# Altium project project.PrjPcb
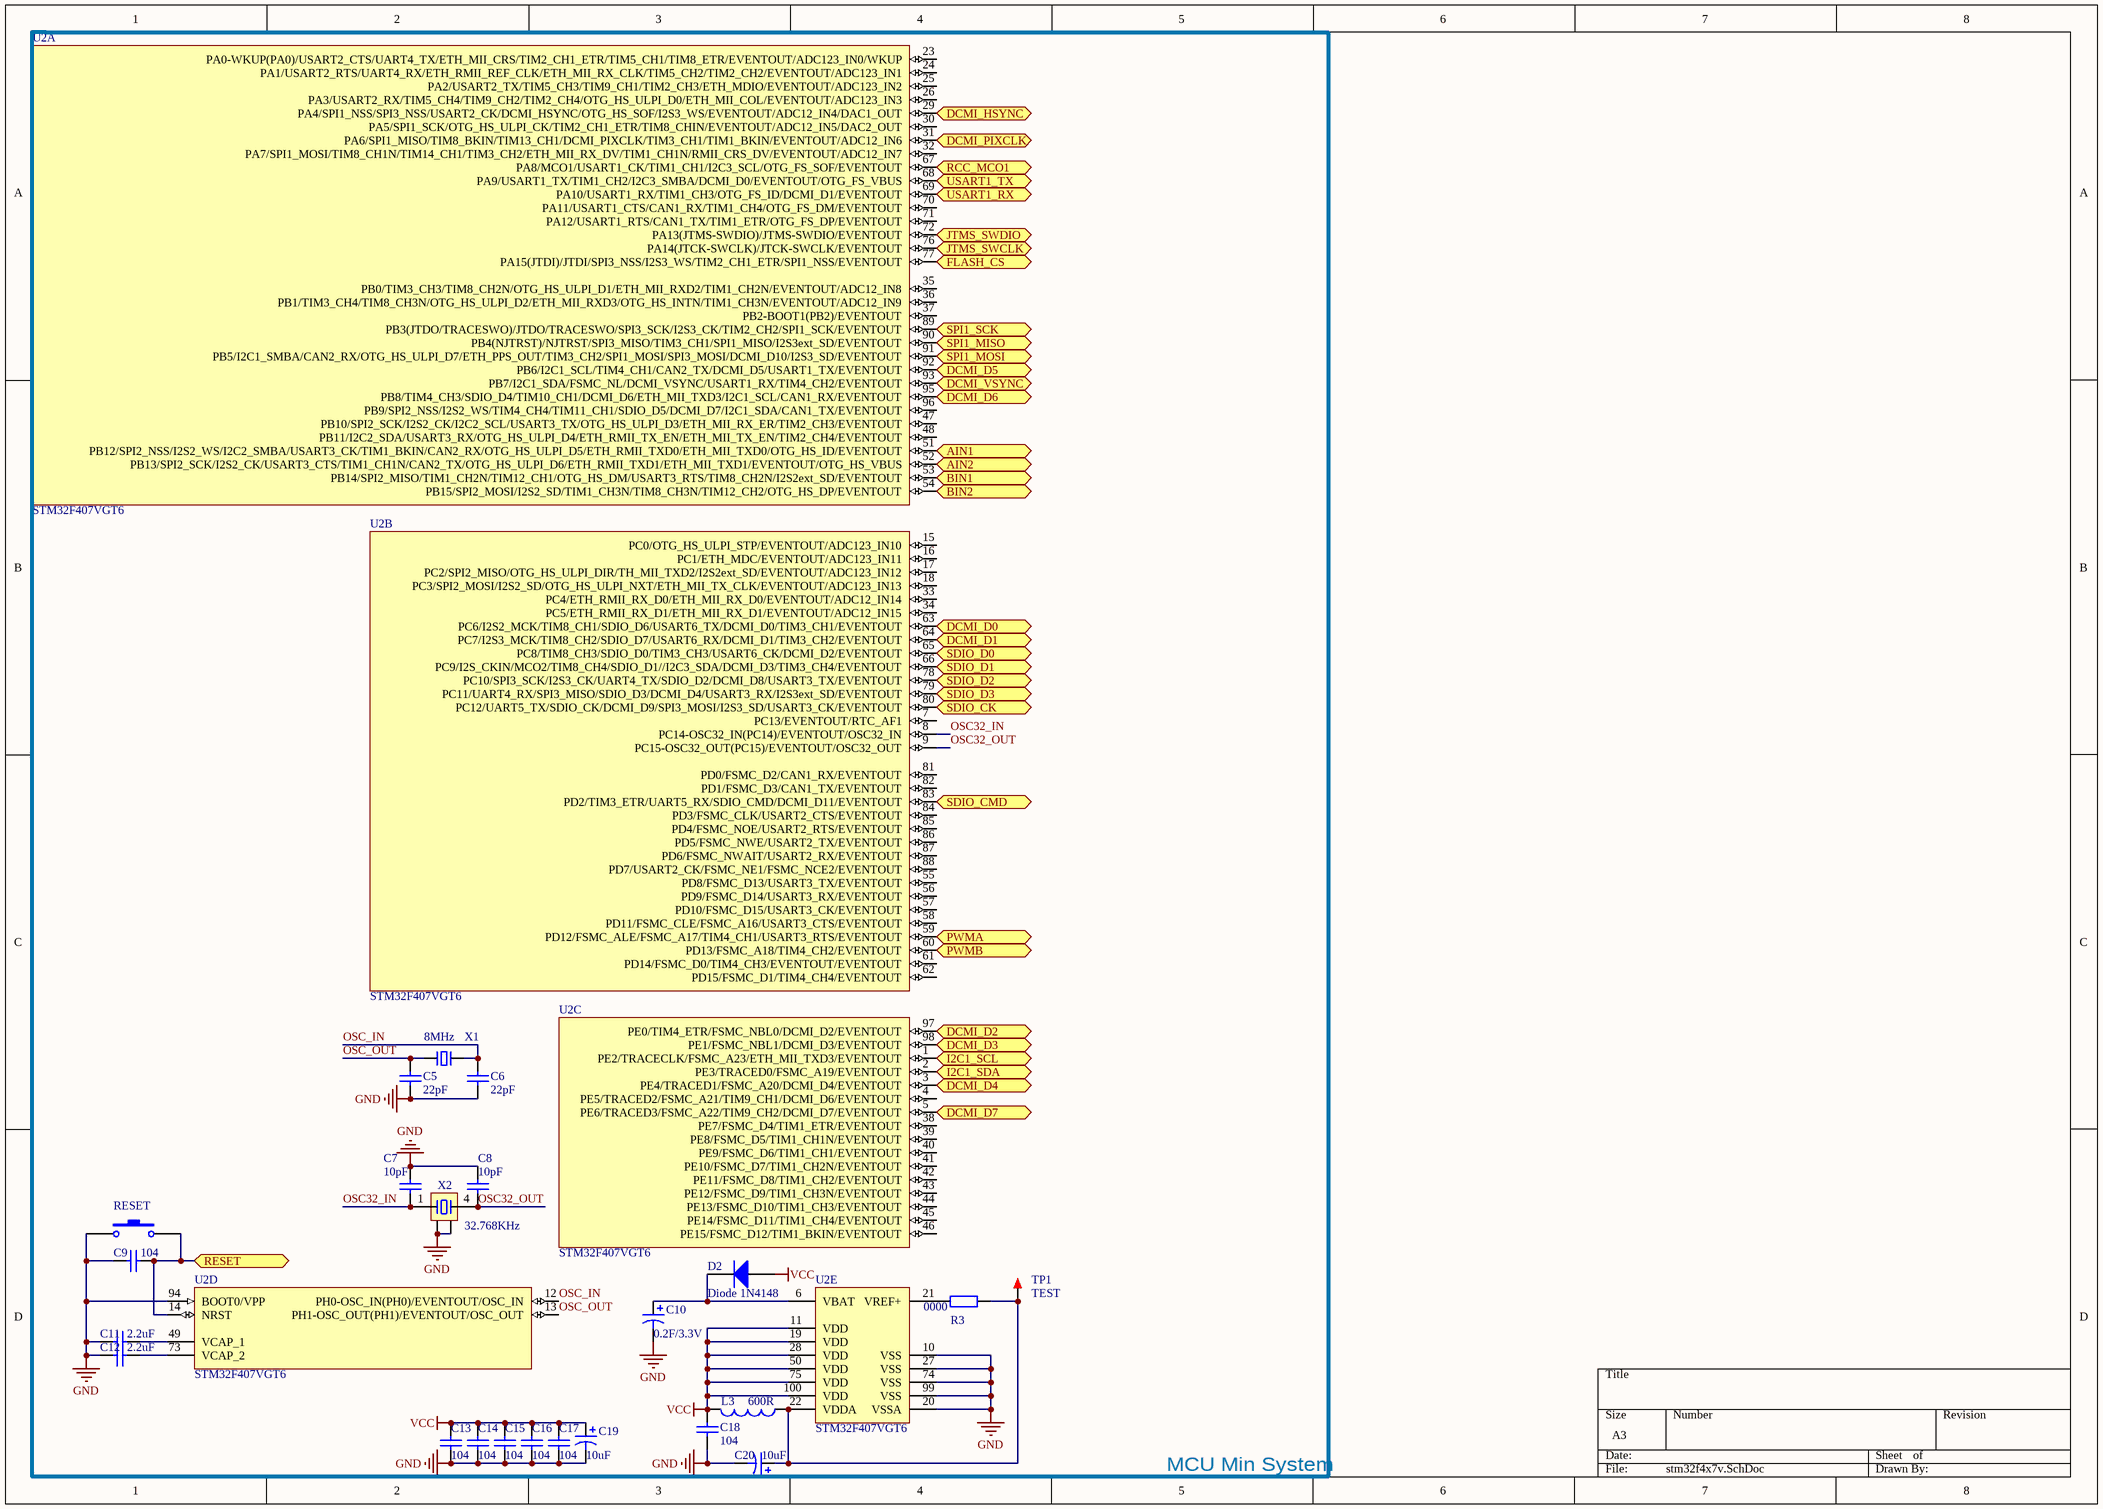
[diagram p0: stm32f4x7v.SchDoc]
5 sheets, 42 parts. Net scope: flat (ports and power ports of the same name join across sheets).
Board file: main_control_board.PcbDoc
Sheets:
  stm32f4x7v.SchDoc
  debug_interface.SchDoc
  power.SchDoc
  spi_flash.SchDoc
  tb6612fng.SchDoc

## Sheet stm32f4x7v.SchDoc
size A3

### Parts
C5  22pF  [C 0603_L]
C6  22pF  [C 0603_L]
C7  10pF  [C 0603_L]
C8  10pF  [C 0603_L]
C9  104  [C 0603_L]
C10  0.2F/3.3V  [CD A(3216)]
C11  2.2uF  [C 0603_L]
C12  2.2uF  [C 0603_L]
C13  104  [C 0603_L]
C14  104  [C 0603_L]
C15  104  [C 0603_L]
C16  104  [C 0603_L]
C17  104  [C 0603_L]
C18  104  [C 0603_L]
C19  10uF  [CD A(3216)]
C20  10uF  [CD A(3216)]
D2  Diode 1N4148  [SOD-523]
L3  value 600R  [R 0603_L]  (hidden comment: Inductor)
R3  0000  [R 0603_L]
RESET  RESET  [micro button_2_SMD]  (value not drawn)
TP1  TEST  [TEST 0.8]
U2  STM32F407VGT6  [LQFP100_V]  (parts A,B,C,D,E of 5)
X1  8MHz  [OSC 5032-2P]
X2  32.768KHz  [OSC MC-146]

### Blocks framed on the sheet
MCU Min System: C5-C20 D2 L3 R3 RESET TP1 U2 X1 X2

### Ports
AIN1 (bidir), AIN2 (bidir), BIN1 (bidir), BIN2 (bidir), DCMI_D0 (bidir), DCMI_D1 (bidir), DCMI_D2 (bidir), DCMI_D3 (bidir), DCMI_D4 (bidir), DCMI_D5 (bidir), DCMI_D6 (bidir), DCMI_D7 (bidir), DCMI_HSYNC (bidir), DCMI_PIXCLK (bidir), DCMI_VSYNC (bidir), FLASH_CS (bidir), I2C1_SCL (bidir), I2C1_SDA (bidir), JTMS_SWCLK (bidir), JTMS_SWDIO (bidir), PWMA (bidir), PWMB (bidir), RCC_MCO1 (bidir), RESET (bidir), SDIO_CK (bidir), SDIO_CMD (bidir), SDIO_D0 (bidir), SDIO_D1 (bidir), SDIO_D2 (bidir), SDIO_D3 (bidir), SPI1_MISO (bidir), SPI1_MOSI (bidir), SPI1_SCK (bidir), USART1_RX (bidir), USART1_TX (bidir)

### Nets
GND: C5.1 C6.1 C7.2 C8.2 C9.1 C10.2 C11.1 C12.1 C13.1 C14.1 C15.1 C16.1 C17.1 C18.1 C19.2 C20.2 RESET.1 U2.10(VSS) U2.20(VSSA) U2.27(VSS) U2.74(VSS) U2.94(BOOT0/VPP) U2.99(VSS) X2.2 X2.3
VCC: C13.2 C14.2 C15.2 C16.2 C17.2 C18.2 C19.1 D2.1(A) L3.2 U2.11(VDD) U2.19(VDD) U2.28(VDD) U2.50(VDD) U2.75(VDD) U2.100(VDD)
OSC32_IN: C7.1 U2.8(PC14-OSC32_IN(PC14)/EVENTOUT/OSC32_IN) X2.1
OSC32_OUT: C8.1 U2.9(PC15-OSC32_OUT(PC15)/EVENTOUT/OSC32_OUT) X2.4
OSC_IN: C6.2 U2.12(PH0-OSC_IN(PH0)/EVENTOUT/OSC_IN) X1.2
OSC_OUT: C5.2 U2.13(PH1-OSC_OUT(PH1)/EVENTOUT/OSC_OUT) X1.1
NetC9_2: C9.2 RESET.2 U2.14(NRST) ; port RESET
NetC10_1: C10.1 D2.2(K) U2.6(VBAT)
NetC11_2: C11.2 U2.49(VCAP_1)
NetC12_2: C12.2 U2.73(VCAP_2)
NetC20_1: C20.1 L3.1 R3.1 TP1.1 U2.22(VDDA)
NetIC2_1: U2.77(PA15(JTDI)/JTDI/SPI3_NSS/I2S3_WS/TIM2_CH1_ETR/SPI1_NSS/EVENTOUT) ; port FLASH_CS
NetIC2_2: U2.90(PB4(NJTRST)/NJTRST/SPI3_MISO/TIM3_CH1/SPI1_MISO/I2S3ext_SD/EVENTOUT) ; port SPI1_MISO
NetIC2_5: U2.91(PB5/I2C1_SMBA/CAN2_RX/OTG_HS_ULPI_D7/ETH_PPS_OUT/TIM3_CH2/SPI1_MOSI/SPI3_MOSI/DCMI_D10/I2S3_SD/EVENTOUT) ; port SPI1_MOSI
NetIC2_6: U2.89(PB3(JTDO/TRACESWO)/JTDO/TRACESWO/SPI3_SCK/I2S3_CK/TIM2_CH2/SPI1_SCK/EVENTOUT) ; port SPI1_SCK
NetJP2_2: U2.69(PA10/USART1_RX/TIM1_CH3/OTG_FS_ID/DCMI_D1/EVENTOUT) ; port USART1_RX
NetJP2_3: U2.68(PA9/USART1_TX/TIM1_CH2/I2C3_SMBA/DCMI_D0/EVENTOUT/OTG_FS_VBUS) ; port USART1_TX
NetJP3_2: U2.72(PA13(JTMS-SWDIO)/JTMS-SWDIO/EVENTOUT) ; port JTMS_SWDIO
NetJP3_3: U2.76(PA14(JTCK-SWCLK)/JTCK-SWCLK/EVENTOUT) ; port JTMS_SWCLK
NetR3_2: R3.2 U2.21(VREF+)
NetU2_1: U2.1(PE2/TRACECLK/FSMC_A23/ETH_MII_TXD3/EVENTOUT) ; port I2C1_SCL
NetU2_2: U2.2(PE3/TRACED0/FSMC_A19/EVENTOUT) ; port I2C1_SDA
NetU2_3: U2.3(PE4/TRACED1/FSMC_A20/DCMI_D4/EVENTOUT) ; port DCMI_D4
NetU2_5: U2.5(PE6/TRACED3/FSMC_A22/TIM9_CH2/DCMI_D7/EVENTOUT) ; port DCMI_D7
NetU2_29: U2.29(PA4/SPI1_NSS/SPI3_NSS/USART2_CK/DCMI_HSYNC/OTG_HS_SOF/I2S3_WS/EVENTOUT/ADC12_IN4/DAC1_OUT) ; port DCMI_HSYNC
NetU2_31: U2.31(PA6/SPI1_MISO/TIM8_BKIN/TIM13_CH1/DCMI_PIXCLK/TIM3_CH1/TIM1_BKIN/EVENTOUT/ADC12_IN6) ; port DCMI_PIXCLK
NetU2_51: U2.51(PB12/SPI2_NSS/I2S2_WS/I2C2_SMBA/USART3_CK/TIM1_BKIN/CAN2_RX/OTG_HS_ULPI_D5/ETH_RMII_TXD0/ETH_MII_TXD0/OTG_HS_ID/EVENTOUT) ; port AIN1
NetU2_52: U2.52(PB13/SPI2_SCK/I2S2_CK/USART3_CTS/TIM1_CH1N/CAN2_TX/OTG_HS_ULPI_D6/ETH_RMII_TXD1/ETH_MII_TXD1/EVENTOUT/OTG_HS_VBUS) ; port AIN2
NetU2_53: U2.53(PB14/SPI2_MISO/TIM1_CH2N/TIM12_CH1/OTG_HS_DM/USART3_RTS/TIM8_CH2N/I2S2ext_SD/EVENTOUT) ; port BIN1
NetU2_54: U2.54(PB15/SPI2_MOSI/I2S2_SD/TIM1_CH3N/TIM8_CH3N/TIM12_CH2/OTG_HS_DP/EVENTOUT) ; port BIN2
NetU2_59: U2.59(PD12/FSMC_ALE/FSMC_A17/TIM4_CH1/USART3_RTS/EVENTOUT) ; port PWMA
NetU2_60: U2.60(PD13/FSMC_A18/TIM4_CH2/EVENTOUT) ; port PWMB
NetU2_63: U2.63(PC6/I2S2_MCK/TIM8_CH1/SDIO_D6/USART6_TX/DCMI_D0/TIM3_CH1/EVENTOUT) ; port DCMI_D0
NetU2_64: U2.64(PC7/I2S3_MCK/TIM8_CH2/SDIO_D7/USART6_RX/DCMI_D1/TIM3_CH2/EVENTOUT) ; port DCMI_D1
NetU2_65: U2.65(PC8/TIM8_CH3/SDIO_D0/TIM3_CH3/USART6_CK/DCMI_D2/EVENTOUT) ; port SDIO_D0
NetU2_66: U2.66(PC9/I2S_CKIN/MCO2/TIM8_CH4/SDIO_D1//I2C3_SDA/DCMI_D3/TIM3_CH4/EVENTOUT) ; port SDIO_D1
NetU2_67: U2.67(PA8/MCO1/USART1_CK/TIM1_CH1/I2C3_SCL/OTG_FS_SOF/EVENTOUT) ; port RCC_MCO1
NetU2_78: U2.78(PC10/SPI3_SCK/I2S3_CK/UART4_TX/SDIO_D2/DCMI_D8/USART3_TX/EVENTOUT) ; port SDIO_D2
NetU2_79: U2.79(PC11/UART4_RX/SPI3_MISO/SDIO_D3/DCMI_D4/USART3_RX/I2S3ext_SD/EVENTOUT) ; port SDIO_D3
NetU2_80: U2.80(PC12/UART5_TX/SDIO_CK/DCMI_D9/SPI3_MOSI/I2S3_SD/USART3_CK/EVENTOUT) ; port SDIO_CK
NetU2_83: U2.83(PD2/TIM3_ETR/UART5_RX/SDIO_CMD/DCMI_D11/EVENTOUT) ; port SDIO_CMD
NetU2_92: U2.92(PB6/I2C1_SCL/TIM4_CH1/CAN2_TX/DCMI_D5/USART1_TX/EVENTOUT) ; port DCMI_D5
NetU2_93: U2.93(PB7/I2C1_SDA/FSMC_NL/DCMI_VSYNC/USART1_RX/TIM4_CH2/EVENTOUT) ; port DCMI_VSYNC
NetU2_95: U2.95(PB8/TIM4_CH3/SDIO_D4/TIM10_CH1/DCMI_D6/ETH_MII_TXD3/I2C1_SCL/CAN1_RX/EVENTOUT) ; port DCMI_D6
NetU2_97: U2.97(PE0/TIM4_ETR/FSMC_NBL0/DCMI_D2/EVENTOUT) ; port DCMI_D2
NetU2_98: U2.98(PE1/FSMC_NBL1/DCMI_D3/EVENTOUT) ; port DCMI_D3

Not connected (* = marked no-connect by the designer): U2 4(PE5/TRACED2/FSMC_A21/TIM9_CH1/DCMI_D6/EVENTOUT) 7(PC13/EVENTOUT/RTC_AF1) 15(PC0/OTG_HS_ULPI_STP/EVENTOUT/ADC123_IN10) 16(PC1/ETH_MDC/EVENTOUT/ADC123_IN11) 17(PC2/SPI2_MISO/OTG_HS_ULPI_DIR/TH_MII_TXD2/I2S2ext_SD/EVENTOUT/ADC123_IN12) 18(PC3/SPI2_MOSI/I2S2_SD/OTG_HS_ULPI_NXT/ETH_MII_TX_CLK/EVENTOUT/ADC123_IN13) 23(PA0-WKUP(PA0)/USART2_CTS/UART4_TX/ETH_MII_CRS/TIM2_CH1_ETR/TIM5_CH1/TIM8_ETR/EVENTOUT/ADC123_IN0/WKUP) 24(PA1/USART2_RTS/UART4_RX/ETH_RMII_REF_CLK/ETH_MII_RX_CLK/TIM5_CH2/TIM2_CH2/EVENTOUT/ADC123_IN1) 25(PA2/USART2_TX/TIM5_CH3/TIM9_CH1/TIM2_CH3/ETH_MDIO/EVENTOUT/ADC123_IN2) 26(PA3/USART2_RX/TIM5_CH4/TIM9_CH2/TIM2_CH4/OTG_HS_ULPI_D0/ETH_MII_COL/EVENTOUT/ADC123_IN3) 30(PA5/SPI1_SCK/OTG_HS_ULPI_CK/TIM2_CH1_ETR/TIM8_CHIN/EVENTOUT/ADC12_IN5/DAC2_OUT) 32(PA7/SPI1_MOSI/TIM8_CH1N/TIM14_CH1/TIM3_CH2/ETH_MII_RX_DV/TIM1_CH1N/RMII_CRS_DV/EVENTOUT/ADC12_IN7) 33(PC4/ETH_RMII_RX_D0/ETH_MII_RX_D0/EVENTOUT/ADC12_IN14) 34(PC5/ETH_RMII_RX_D1/ETH_MII_RX_D1/EVENTOUT/ADC12_IN15) 35(PB0/TIM3_CH3/TIM8_CH2N/OTG_HS_ULPI_D1/ETH_MII_RXD2/TIM1_CH2N/EVENTOUT/ADC12_IN8) 36(PB1/TIM3_CH4/TIM8_CH3N/OTG_HS_ULPI_D2/ETH_MII_RXD3/OTG_HS_INTN/TIM1_CH3N/EVENTOUT/ADC12_IN9) 37(PB2-BOOT1(PB2)/EVENTOUT) 38(PE7/FSMC_D4/TIM1_ETR/EVENTOUT) 39(PE8/FSMC_D5/TIM1_CH1N/EVENTOUT) 40(PE9/FSMC_D6/TIM1_CH1/EVENTOUT) 41(PE10/FSMC_D7/TIM1_CH2N/EVENTOUT) 42(PE11/FSMC_D8/TIM1_CH2/EVENTOUT) 43(PE12/FSMC_D9/TIM1_CH3N/EVENTOUT) 44(PE13/FSMC_D10/TIM1_CH3/EVENTOUT) 45(PE14/FSMC_D11/TIM1_CH4/EVENTOUT) 46(PE15/FSMC_D12/TIM1_BKIN/EVENTOUT) 47(PB10/SPI2_SCK/I2S2_CK/I2C2_SCL/USART3_TX/OTG_HS_ULPI_D3/ETH_MII_RX_ER/TIM2_CH3/EVENTOUT) 48(PB11/I2C2_SDA/USART3_RX/OTG_HS_ULPI_D4/ETH_RMII_TX_EN/ETH_MII_TX_EN/TIM2_CH4/EVENTOUT) 55(PD8/FSMC_D13/USART3_TX/EVENTOUT) 56(PD9/FSMC_D14/USART3_RX/EVENTOUT) 57(PD10/FSMC_D15/USART3_CK/EVENTOUT) 58(PD11/FSMC_CLE/FSMC_A16/USART3_CTS/EVENTOUT) 61(PD14/FSMC_D0/TIM4_CH3/EVENTOUT/EVENTOUT) 62(PD15/FSMC_D1/TIM4_CH4/EVENTOUT) 70(PA11/USART1_CTS/CAN1_RX/TIM1_CH4/OTG_FS_DM/EVENTOUT) 71(PA12/USART1_RTS/CAN1_TX/TIM1_ETR/OTG_FS_DP/EVENTOUT) 81(PD0/FSMC_D2/CAN1_RX/EVENTOUT) 82(PD1/FSMC_D3/CAN1_TX/EVENTOUT) 84(PD3/FSMC_CLK/USART2_CTS/EVENTOUT) 85(PD4/FSMC_NOE/USART2_RTS/EVENTOUT) 86(PD5/FSMC_NWE/USART2_TX/EVENTOUT) 87(PD6/FSMC_NWAIT/USART2_RX/EVENTOUT) 88(PD7/USART2_CK/FSMC_NE1/FSMC_NCE2/EVENTOUT) 96(PB9/SPI2_NSS/I2S2_WS/TIM4_CH4/TIM11_CH1/SDIO_D5/DCMI_D7/I2C1_SDA/CAN1_TX/EVENTOUT)

### Library data of the parts
C5-C9 C11-C18 = Cap: Capacitor; Published: 8-Jun-2000; LatestRevisionDate: 17-Jul-2002; LatestRevisionNote: Re-released for DXP Platform.; PackageReference: RAD-0.3; Publisher: Altium Limited; PackageDescription: Radial Cap, Thru-Hole; 2 Leads; 0.3 in Pin Spacing
  C5 C6: Value: 22pF
  C7 C8: Value: 10pF
  C9 C13-C18: Value: 104
  C11 C12: Value: 2.2uF
C10 C19 C20 = Cap Pol1: Polarized Capacitor (Radial); Published: 8-Jun-2000; LatestRevisionDate: 17-Jul-2002; LatestRevisionNote: Re-released for DXP Platform.; PackageReference: RB7.6-15; Publisher: Altium Limited; PackageDescription: Polarized Capacitor (Radial); 2 Leads
  C10: Value: 0.2F/3.3V
  C19 C20: Value: 10uF
D2 = Diode 1N4148: High Conductance Fast Diode; Published: 8-Jun-2000; LatestRevisionDate: 17-Jul-2002; LatestRevisionNote: Re-released for DXP Platform.; DatasheetVersion: 1997; PackageReference: DO-35; Publisher: Altium Limited; PackageDescription: Diode, Axial; Body 3.8 x 1.9 mm (LxDia. max), Lead Dia. 0.53 mm (max); Code_JEDEC: DO-204-AH; ComponentLink1Description: Manufacturer Link; ComponentLink1URL: http://www.fairchildsemi.com/; ComponentLink2Description: Datasheet; ComponentLink2URL: http://www.fairchildsemi.com/ds/1N%2F1N4148.pdf
L3 = Inductor: Code_IEC: 1005; Published: 8-Jun-2000; LatestRevisionDate: 29-May-2009; LatestRevisionNote: IPC-7351 Footprint Added.; PackageReference: 0402-A; Publisher: Altium Limited; PackageDescription: Chip Inductor; Code_JEITA: 0402
R3 = Res2: Resistor; Published: 8-Jun-2000; LatestRevisionDate: 17-Jul-2002; LatestRevisionNote: Re-released for DXP Platform.; PackageReference: AXIAL-0.4; Publisher: Altium Limited; PackageDescription: Axial Device, Thru-Hole; 2 Leads; 0.4 in Pin Spacing; Value: 0000
RESET = SW-PB: Switch; Published: 24-Mar-1999; LatestRevisionDate: 17-Jul-2002; LatestRevisionNote: Re-released for DXP Platform.; PackageReference: SPST-2; Publisher: Altium Limited; PackageDescription: Switch; 2 Leads
TP1 = TEST: 测试点; 版权归属: 源创客; BOM名称: 测试点; 学习资源: www.ooocke.com
U2 = STM32F407VGT6: ARM Cortex-M4 32b MCU+FPU, 210DMIP, 1024 kB Flash, 192+4 kB RAM, Camera, 82 I/Os, 100-pin LQFP, -40 to +85癈, Tray; Internal RAM: 192kB; Operating Frequency (Processor Speed): 168MHz; A/D Converter: 16x12-bit; D/A Converter: 2x12-bit; 16-bit Timers (IC/OC/PWM): 12x16-bit(24/24/30); 32-bit Timer (IC/OC/PWM): 2x32-bit (8/8/8); Other Timer Functions: 2xWDG, RTC, 24-bit down counter; Serial Interface: 3xSPI/2xI2S/2xI2C/3xUSART(IrDa, ISO7816)/3xUART/2xUSB OTG FS/HS, 2xCAN/Ethernet MAC10/100, SDIO; DatasheetVersion: rev2, Jan-2012; PackageVersion: 2012; PackageReference: LQFP100; PackageDescription: 100-Pin Low Profile Quad Flat Package, 14x14 mm Body, 0.5 mm Pitch; ComponentLink1Description: Manufacturer URL; ComponentLink1URL: http://www.st.com/; ComponentLink2Description: STM32F405/7 Datasheet; ComponentLink2URL: http://www.st.com/internet/com/TECHNICAL_RESOURCES/TECHNICAL_LITERATURE/DATASHEET/DM00037051.pdf; ComponentLink3Description: STM32F4 Web Page; ComponentLink3URL: http://www.st.com/internet/mcu/subclass/1521.jsp
X1 = XTAL-2P: 2脚无源脚晶振; 版权归属: 源创客; BOM名称: 2脚无源脚晶振; 学习资源: www.ooocke.com
X2 = XTAL-MC-4P: MC系列4脚晶振; BOM名称: 2脚无源脚晶振; 版权归属: 源创客; 学习资源: www.ooocke.com

## Sheet debug_interface.SchDoc
size A4
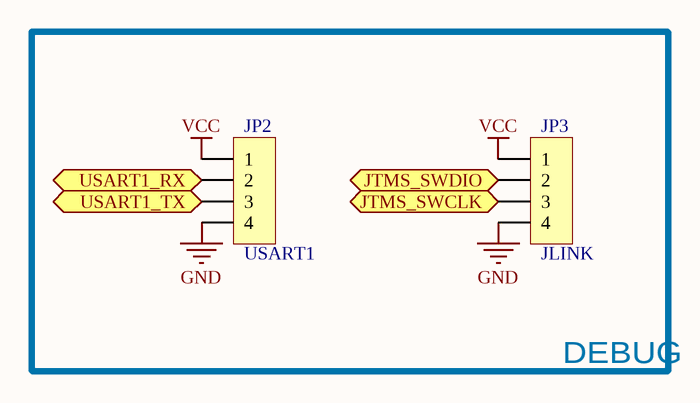
[diagram p1: debug_interface.SchDoc]

### Parts
JP2  USART1  [MX 1.25-LS-4P]
JP3  JLINK  [MX 1.25-LS-4P]

### Blocks framed on the sheet
DEBUG: JP2 JP3

### Ports
JTMS_SWCLK (bidir), JTMS_SWDIO (bidir), USART1_RX (bidir), USART1_TX (bidir)

### Nets
GND: JP2.4 JP3.4
VCC: JP2.1 JP3.1
NetJP2_2: JP2.2 ; port USART1_RX
NetJP2_3: JP2.3 ; port USART1_TX
NetJP3_2: JP3.2 ; port JTMS_SWDIO
NetJP3_3: JP3.3 ; port JTMS_SWCLK

### Library data of the parts
JP2 JP3 = Header 4: 4P接插件; 版权归属: 源创客; BOM名称: 4P接插件; 学习资源: www.ooocke.com

## Sheet power.SchDoc
size A4
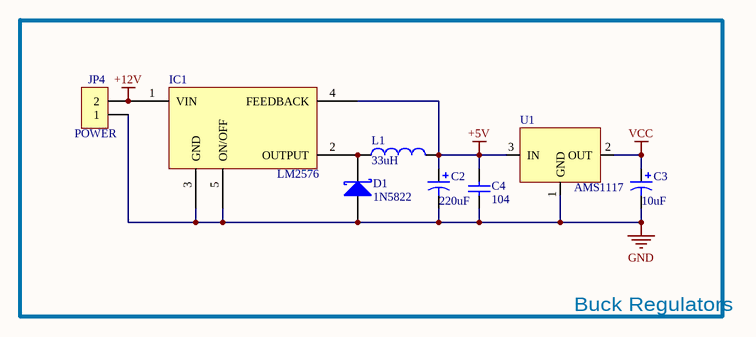
[diagram p2: power.SchDoc]

### Parts
C2  220uF  [CM E(8*10.2)]
C3  10uF  [CD A(3216)]
C4  104  [C 0603_L]
D1  1N5822  [DO_201_AD]
IC1  LM2576  [TO263-5A]
JP4  POWER  [KF128-5.08-2P]
L1  33uH  [CDRH127]
U1  AMS1117  [SOT_223]

### Blocks framed on the sheet
Buck Regulators: C2-C4 D1 IC1 JP4 L1 U1

### Nets
+5V: C2.1 C4.2 IC1.4(FEEDBACK) L1.2 U1.3(IN)
+12V: IC1.1(VIN) JP4.2
GND: C2.2 C3.2 C4.1 D1.1(A) IC1.3(GND) IC1.5(ON/OFF) JP4.1 U1.1(GND)
VCC: C3.1 U1.2(OUT)
NetD1_2: D1.2(K) IC1.2(OUTPUT) L1.1

### Library data of the parts
C2 C3 = Cap Pol1: Polarized Capacitor (Radial); Published: 8-Jun-2000; LatestRevisionDate: 17-Jul-2002; LatestRevisionNote: Re-released for DXP Platform.; PackageReference: RB7.6-15; Publisher: Altium Limited; PackageDescription: Polarized Capacitor (Radial); 2 Leads
  C2: Value: 220uF
  C3: Value: 10uF
C4 = Cap: Capacitor; Published: 8-Jun-2000; LatestRevisionDate: 17-Jul-2002; LatestRevisionNote: Re-released for DXP Platform.; PackageReference: RAD-0.3; Publisher: Altium Limited; PackageDescription: Radial Cap, Thru-Hole; 2 Leads; 0.3 in Pin Spacing; Value: 104
D1 = Diode 11DQ03: Schottky Rectifier; Published: 8-Jun-2000; LatestRevisionDate: 17-Jul-2002; LatestRevisionNote: Re-released for DXP Platform.; DatasheetVersion: Dec-1997; PackageReference: DO-204AL; Publisher: Altium Limited; PackageDescription: Diode, Axial; Body 5.2 x 2.7 mm (LxDia. max), Lead Dia. 0.86 mm (max); Code_JEDEC: DO-204-AL; ComponentLink1Description: Manufacturer Link; ComponentLink1URL: http://www.irf.com/; ComponentLink2Description: Datasheet; ComponentLink2URL: http://www.irf.com/product-info/datasheets/data/11dq03.pdf
IC1 = LM2576: 稳压
JP4 = Header 2: 2P接插件; 版权归属: 源创客; BOM名称: 2P接插件; 学习资源: www.ooocke.com
L1 = Inductor: Code_IEC: 1005; Published: 8-Jun-2000; LatestRevisionDate: 29-May-2009; LatestRevisionNote: IPC-7351 Footprint Added.; PackageReference: 0402-A; Publisher: Altium Limited; PackageDescription: Chip Inductor; Code_JEITA: 0402; Value: 33uH

## Sheet spi_flash.SchDoc
size A4
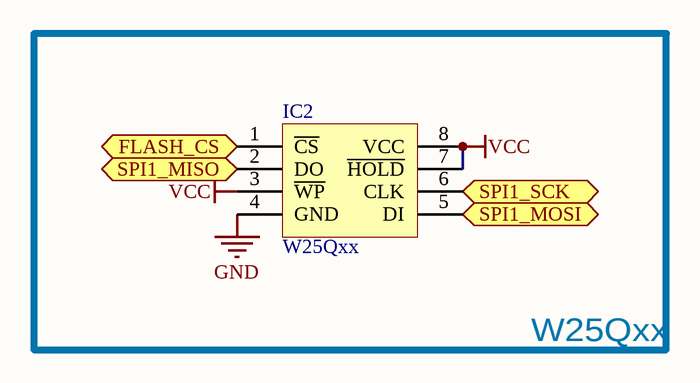
[diagram p3: spi_flash.SchDoc]

### Parts
IC2  W25Qxx  [SOP8W_N]

### Blocks framed on the sheet
W25Qxx: IC2

### Ports
FLASH_CS (bidir), SPI1_MISO (bidir), SPI1_MOSI (bidir), SPI1_SCK (bidir)

### Nets
GND: IC2.4(GND)
VCC: IC2.3(~{WP}) IC2.7(~{HOLD}) IC2.8(VCC)
NetIC2_1: IC2.1(~{CS}) ; port FLASH_CS
NetIC2_2: IC2.2(DO) ; port SPI1_MISO
NetIC2_5: IC2.5(DI) ; port SPI1_MOSI
NetIC2_6: IC2.6(CLK) ; port SPI1_SCK

### Library data of the parts
IC2 = W25Qxx: 外置Flash; 版权归属: 源创客; BOM名称: 外置Flash; 学习资源: www.ooocke.com

## Sheet tb6612fng.SchDoc
size A4
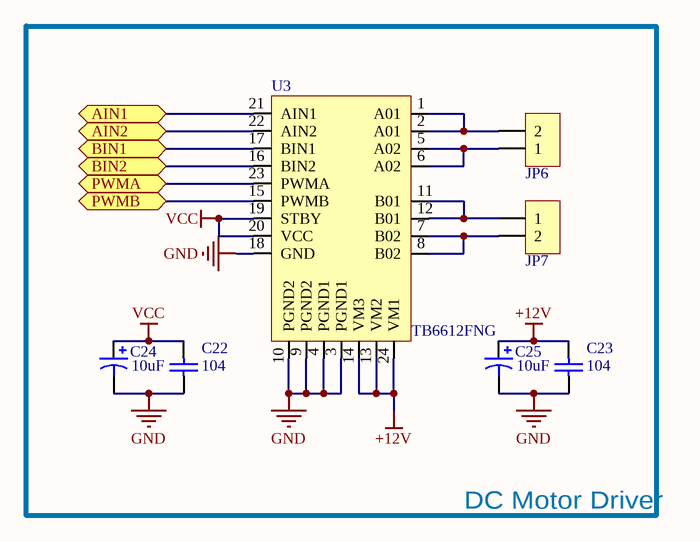
[diagram p4: tb6612fng.SchDoc]

### Parts
C22  104  [C 0603_L]
C23  104  [C 0603_L]
C24  10uF  [CD A(3216)]
C25  10uF  [CD A(3216)]
JP6  HDR-1X2  [XH2.54-LI-2P]  (value not drawn)
JP7  HDR-1X2  [XH2.54-LI-2P]  (value not drawn)
U3  TB6612FNG  [SSOP24_N]

### Blocks framed on the sheet
DC Motor Driver: C22-C25 JP6 JP7 U3

### Ports
AIN1 (bidir), AIN2 (bidir), BIN1 (bidir), BIN2 (bidir), PWMA (bidir), PWMB (bidir)

### Nets
+12V: C23.2 C25.1 U3.13(VM2) U3.14(VM3) U3.24(VM1)
GND: C22.1 C23.1 C24.2 C25.2 U3.3(PGND1) U3.4(PGND1) U3.9(PGND2) U3.10(PGND2) U3.18(GND)
VCC: C22.2 C24.1 U3.19(STBY) U3.20(VCC)
NetJP6_1: JP6.1 U3.5(A02) U3.6(A02)
NetJP6_2: JP6.2 U3.1(A01) U3.2(A01)
NetJP7_1: JP7.1 U3.11(B01) U3.12(B01)
NetJP7_2: JP7.2 U3.7(B02) U3.8(B02)
NetU2_51: U3.21(AIN1) ; port AIN1
NetU2_52: U3.22(AIN2) ; port AIN2
NetU2_53: U3.17(BIN1) ; port BIN1
NetU2_54: U3.16(BIN2) ; port BIN2
NetU2_59: U3.23(PWMA) ; port PWMA
NetU2_60: U3.15(PWMB) ; port PWMB

### Library data of the parts
C22 C23 = Cap: Capacitor; Published: 8-Jun-2000; LatestRevisionDate: 17-Jul-2002; LatestRevisionNote: Re-released for DXP Platform.; PackageReference: RAD-0.3; Publisher: Altium Limited; PackageDescription: Radial Cap, Thru-Hole; 2 Leads; 0.3 in Pin Spacing; Value: 104
C24 C25 = Cap Pol1: Polarized Capacitor (Radial); Published: 8-Jun-2000; LatestRevisionDate: 17-Jul-2002; LatestRevisionNote: Re-released for DXP Platform.; PackageReference: RB7.6-15; Publisher: Altium Limited; PackageDescription: Polarized Capacitor (Radial); 2 Leads; Value: 10uF
JP6 JP7 = Header 2: 2P接插件; 版权归属: 源创客; BOM名称: 2P接插件; 学习资源: www.ooocke.com
U3 = TB6612FNG: DC_MOTOR_DRIVER

## Nets that join several sheets
+12V: power (IC1.1 JP4.2), tb6612fng (5 pins)
GND: stm32f4x7v (25 pins), debug_interface (JP2.4 JP3.4), power (8 pins), spi_flash (IC2.4), tb6612fng (9 pins)
VCC: stm32f4x7v (15 pins), debug_interface (JP2.1 JP3.1), power (C3.1 U1.2), spi_flash (IC2.3 IC2.7 IC2.8), tb6612fng (C22.2 C24.1 U3.19 U3.20)
NetIC2_1: stm32f4x7v (U2.77), spi_flash (IC2.1)
NetIC2_2: stm32f4x7v (U2.90), spi_flash (IC2.2)
NetIC2_5: stm32f4x7v (U2.91), spi_flash (IC2.5)
NetIC2_6: stm32f4x7v (U2.89), spi_flash (IC2.6)
NetJP2_2: stm32f4x7v (U2.69), debug_interface (JP2.2)
NetJP2_3: stm32f4x7v (U2.68), debug_interface (JP2.3)
NetJP3_2: stm32f4x7v (U2.72), debug_interface (JP3.2)
NetJP3_3: stm32f4x7v (U2.76), debug_interface (JP3.3)
NetU2_51: stm32f4x7v (U2.51), tb6612fng (U3.21)
NetU2_52: stm32f4x7v (U2.52), tb6612fng (U3.22)
NetU2_53: stm32f4x7v (U2.53), tb6612fng (U3.17)
NetU2_54: stm32f4x7v (U2.54), tb6612fng (U3.16)
NetU2_59: stm32f4x7v (U2.59), tb6612fng (U3.23)
NetU2_60: stm32f4x7v (U2.60), tb6612fng (U3.15)